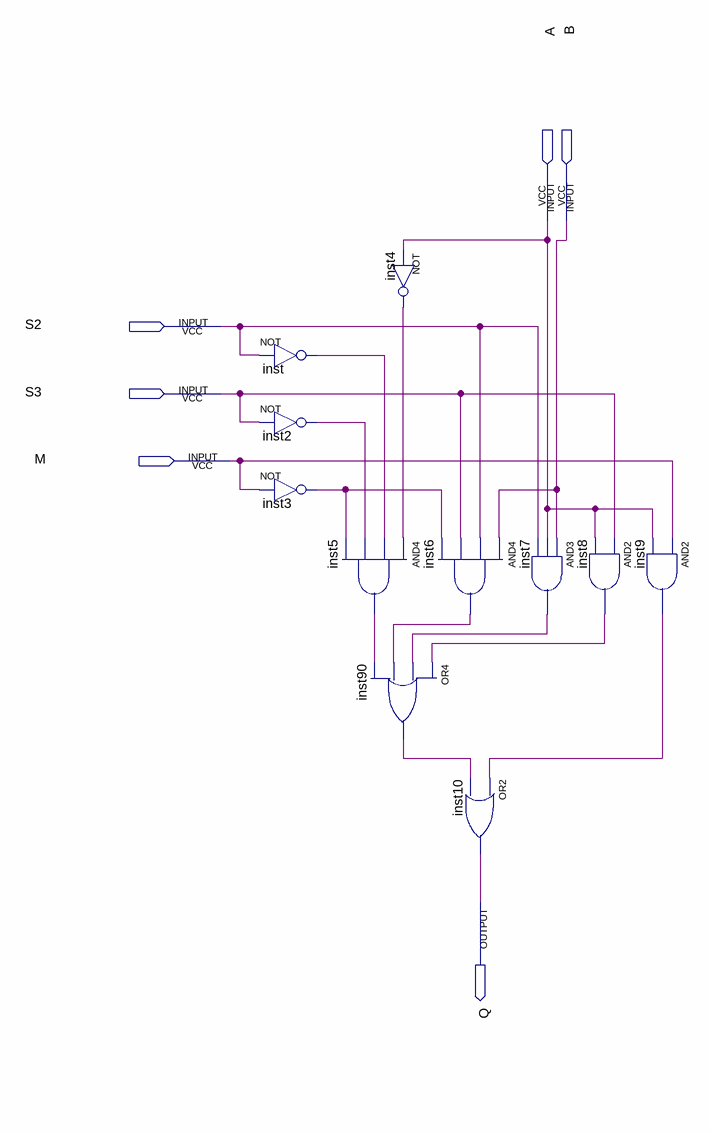
[diagram p0: schematic sheet]
// Quartus schematic LE.bdf as structural Verilog: 11 symbols, 6 pins
module LE (
  input  A,
  input  B,
  input  S2,
  input  S3,
  input  M,
  output Q
);

  wire inst2_out, inst3_out, inst4_out, inst5_out, inst6_out, inst7_out, inst8_out, inst9_out, inst90_out,
       inst_out;

  not inst (inst_out, S2);
  not inst2 (inst2_out, S3);
  not inst3 (inst3_out, M);
  and inst5 (inst5_out, inst4_out, inst_out, inst2_out, inst3_out);
  not inst4 (inst4_out, A);
  or inst90 (inst90_out, inst8_out, inst7_out, inst6_out, inst5_out);
  and inst6 (inst6_out, B, S2, S3, inst3_out);
  or inst10 (Q, inst9_out, inst90_out);
  and inst7 (inst7_out, B, A, S2);
  and inst8 (inst8_out, S3, A);
  and inst9 (inst9_out, M, A);
endmodule
